# EAGLE design strip_controller (EAGLE 7.2.0)
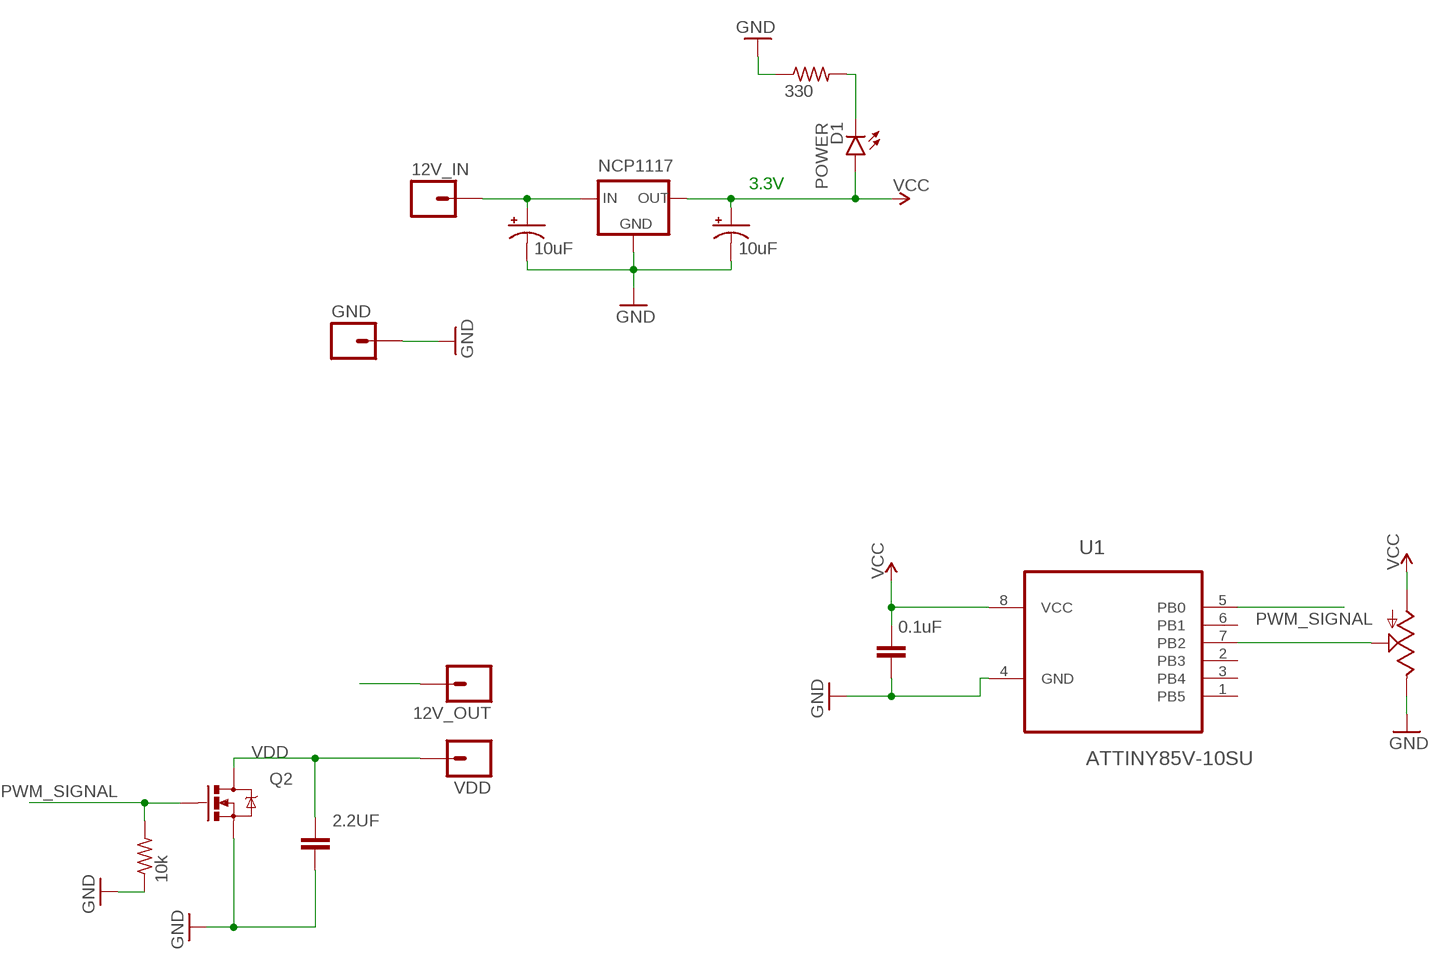
[diagram p0: schematic, sheet 1]

## Parts
12V_IN  WAGO_2060M01  [WAGO_2060]
12V_OUT  WAGO_2060M01  [WAGO_2060]
C2  0.1uF  CAP0805  [0805]
C4  2.2UF  2.2UF50V10%(1206)  [1206]
C5  10uF  CAP-POLCAP-PANASONIC-C  [CAP-PANASONIC-C]
C7  10uF  CAP-POLCAP-PANASONIC-C  [CAP-PANASONIC-C]
D1  POWER  LED-GREEN0603  [LED-0603]
GND  WAGO_2060M01  [WAGO_2060]
NCP1117  VREG-3.3VNCP1117  [TO-252]
Q2  MOSFET-NCHANNELFDD8780  [DPAK]
U1  ATTINY85V-10SU  [SOIC127P798X216-8N]
U$2  BOURNS_SLIDE_POT  [BOURN_SLIDE_POT]
U$3  330  RESISTOR  [RESISTOR-0805]
U$15  10k  RESISTOR  [RESISTOR-0805]
VDD  WAGO_2060M01  [WAGO_2060]

## Nets
3.3V [5V]: C2.1 C7.+ D1.A NCP1117.2(OUT) U1.8(VCC) U$2.P$6 ; supply symbol labelled VCC
12V: 12V_IN.L1.2 12V_OUT.L1.2 C5.+ NCP1117.3(IN)
GND [12V]: C2.2 C4.1 C5.- C7.- GND.L1.2 NCP1117.1(GND) Q2.3(S) U1.4(GND) U$2.P$7 U$3.1 U$15.1
N$4: D1.C U$3.2
PWM_SIGNAL: Q2.1(G) U1.5(PB0) U$15.2
VDD [12V]: C4.2 Q2.4(D) VDD.L1.2
WIPER: U1.7(PB2) U$2.P$5
Unconnected: U1.1(PB5) U1.2(PB3) U1.3(PB4) U1.6(PB1)

## Notes on the sheet
- 3.3V

## Library data of the parts
12V_IN 12V_OUT GND VDD = jt_parts:WAGO_2060
C2 = SparkFun-Capacitors:CAP: Capacitor Standard 0603 ceramic capacitor, and 0.1" leaded capacitor.
C4 = SparkFun-Capacitors:2.2UF50V10%(1206): CAP-10009; PROD_ID: CAP-10009
C5 C7 = jt_parts:CAP-POL: Polarized Caps
D1 = SparkFun-LED:LED-GREEN: Various green LEDs Green LEDs used in SFE Production 0603- DIO-00821 LARGE- DIO-00862 LILYPAD- DIO-09910; PROD_ID: DIO-00821; VALUE: GREEN
NCP1117 = jt_parts:VREG-3.3V
Q2 = SparkFun-DiscreteSemi:MOSFET-NCHANNEL: Common NMOSFET Parts MFG P/N Store ID Prod ID FDD8780 TRANS-09984 SI7820DN TRANS-11055 FDS6630A IC-08089 2N7002PW TRANS-11151 FQP30N06L COM-10213 TRANS-10060 BSS123LT1G TRANS-08345 BSS138 TRANS-00830 BS170 2N7000; PROD_ID: TRANS-09984
U1 = Atmel_By_element14_Batch_1-00:ATTINY85V-10SU: 8-bit Microcontroller with In-System Programmable Flash; MPN: ATTINY85V-10SU; OC_FARNELL: 1455166; OC_NEWARK: 58M3799; PACKAGE: SOIC-8; SUPPLIER: Atmel
U$2 = jt_parts:BOURNS_SLIDE_POT
U$3 U$15 = jt_parts:RESISTOR: Resistor footprints. 0805 modified from Adafruit library.

## Net classes
0 default: width 0.254 mm, clearance 0.203 mm
1 12V: width 2.032 mm, clearance 0.508 mm
2 5V: width 0.305 mm, clearance 0.203 mm

## Board
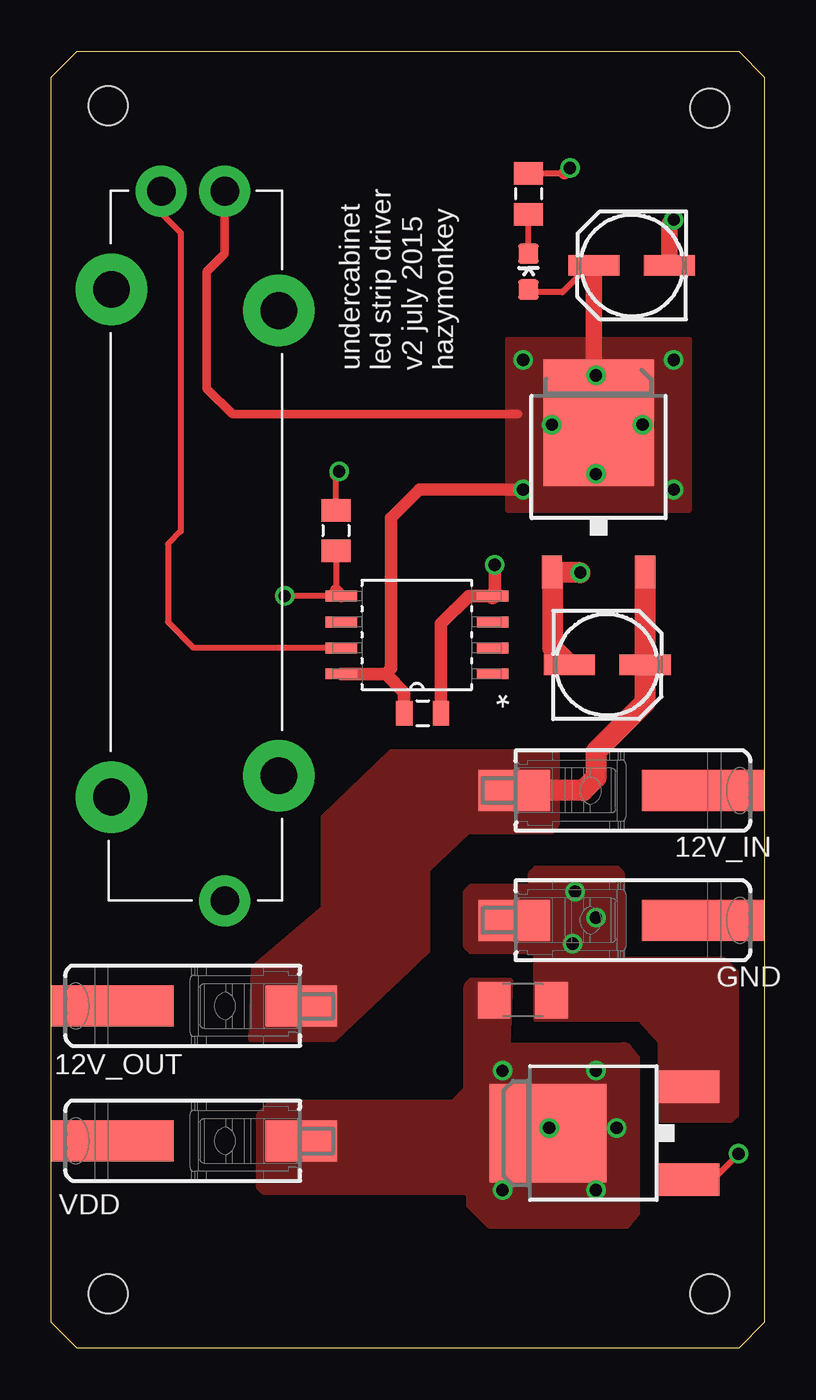
[diagram p1: board, top side]
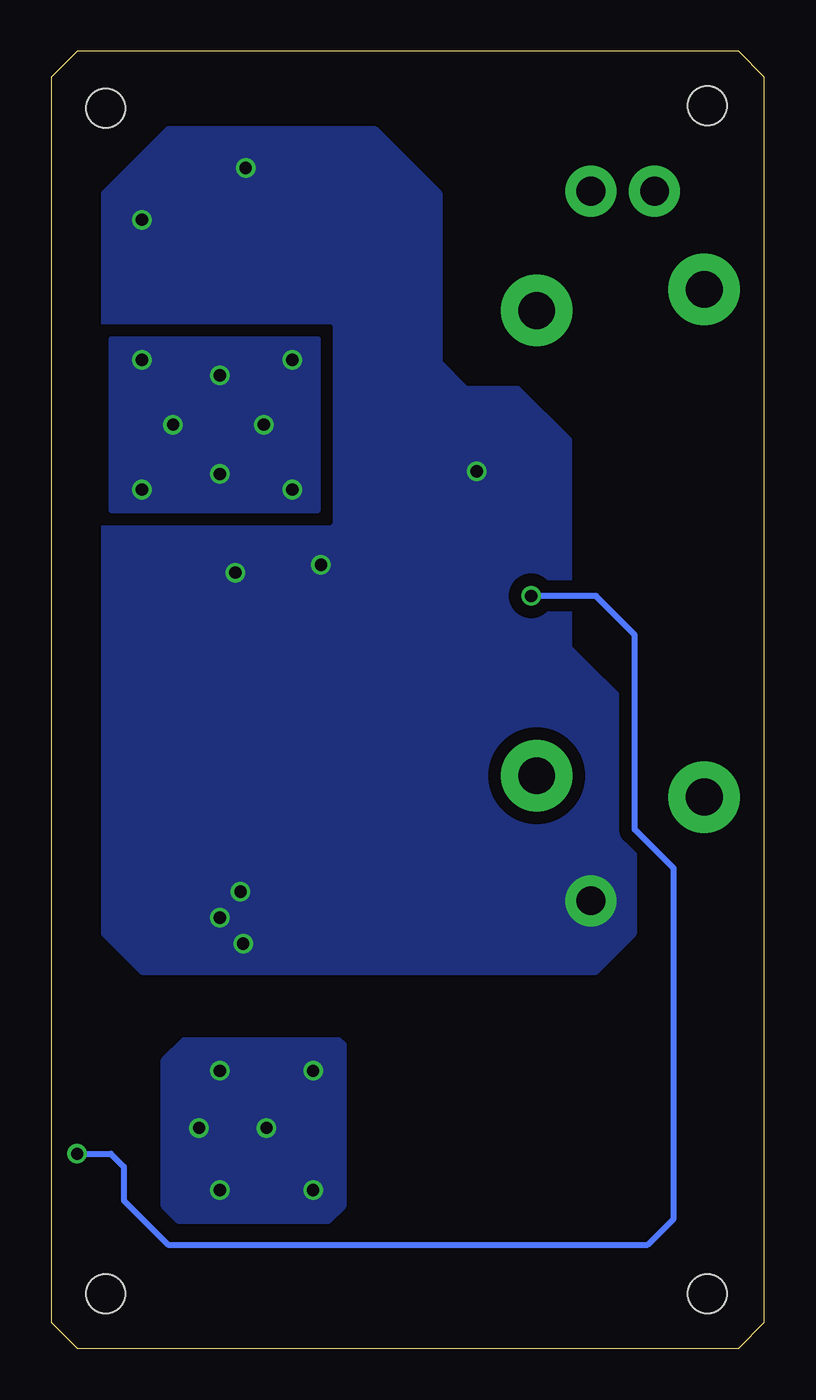
[diagram p2: board, bottom side, seen from below]

Size 34.93 x 63.5 mm. Coordinates in mm from the lower left corner, seen from the top.
Outline: 34.93,62.23 34.93,1.27 33.66,0 1.27,0 0,1.27 0,62.23 1.27,63.5 33.66,63.5 34.93,62.23
Copper layers (1*16): Top 0.0356mm / dielectric 1.5011mm / Bottom 0.0356mm
Design rules "LaenPCBOrder": minimum track width 6mil, minimum drill 13mil, track to track 6mil, track to pad 6mil, pad to pad 6mil, via to via 6mil, smd to smd 6mil, copper to edge 15mil, drill to drill 6mil, minimum pad ring 7mil, minimum via ring 7mil, stop-mask expansion 3mil, vias tented up to drill 0mil, thermal gap 10mil
Holes 1.91 mm at 32.26,2.67 2.79,2.67 32.26,60.71 2.79,60.83

### Footprints (pad centres in the part's own frame; a part is rotated, then mirrored left to right if it is on the bottom)
WAGO_2060 = smd 6 x 2: L1.1 3.355,0 | smd 3.5 x 2: L1.2 -5.895,0
0805 = smd 0.8 x 1.2: 1 -0.9,0; 2 0.9,0
1206 = smd 1.6 x 1.8: 1 -1.4,0; 2 1.4,0
CAP-PANASONIC-C = smd 2.5 x 1: + 1.9,-0.2; - -1.8,-0.2
LED-0603 = smd 1 x 1: A 0,-0.877; C 0,0.877
TO-252 = smd 1 x 1.6: 1 -2.28,-6.07; 3 2.28,-6.07 | smd 5.4 x 6.2: 2 0,1.23
DPAK = smd 1.6 x 3: 1 -2.28,-5.31; 3 2.28,-5.31 | smd 4.826 x 5.715: 4 0,1.588
SOIC127P798X216-8N = smd 1.549 x 0.533: 1 -3.708,1.905; 2 -3.708,0.635; 3 -3.708,-0.635; 4 -3.708,-1.905; 5 3.708,-1.905; 6 3.708,-0.635; 7 3.708,0.635; 8 3.708,1.905
BOURN_SLIDE_POT = drill 1.8 pad 3.5: P$1 -11.43,4.674; P$2 -12.47,-3.526; P$3 12.38,-3.526; P$4 11.341,4.674 | drill 1.4 pad 2.5: P$5 -17.27,-1.087; P$6 -17.27,2.024; P$7 17.457,2.024
RESISTOR-0805 = smd 1.1 x 1.4: 1 -1,0; 2 1,0

### Placement (x,y rotation side)
12V_IN  28.57,27.3 0 top
12V_OUT  6.35,16.76 180 top
C2  18.19,31.09 0 top
C4  23.09,17.04 180 top
C5  27.18,33.66 0 top
C7  28.47,52.81 180 top
D1  23.37,52.7 0 top
GND  28.57,20.95 0 top
NCP1117  26.8,44.07 0 top
Q2  25.91,10.54 90 top
U1  17.91,34.92 180 top
U$2  6.48,39.37 270 top
U$3  23.37,56.52 270 top
U$15  13.94,40.03 270 top
VDD  6.35,10.16 180 top

### Tracks (layer width: path | path; a pad name or v marks a point on that pad's centre or on a via)
3.3V  (via drill 0.6)
  Top 0.305: 26.34,53.01 25.02,51.69 23.51,51.69
  Top 0.406: U$2.P$6 8.5,53.59 7.62,52.7 7.62,46.99 8.89,45.72 22.86,45.72
  Top 0.61: C2.1 17.29,32.12 16.38,33.02 | 16.38,33.02 U1.8 | v23.11,42.04 18.03,42.04 16.64,40.64 16.64,33.27 16.38,33.02 | C7.+ 26.34,53.01 | 23.51,51.69 D1.A
  Top 0.813: C7.+ 26.57,45.52 NCP1117.2
  other vias: 26.67,47.62 30.48,48.39 28.96,45.21 30.48,42.04 26.67,42.8 23.11,48.39 24.51,45.21
  pour Top (no thermals): 22.35,41.02 22.35,49.4 31.24,49.4 31.24,41.02
  pour Bottom (no thermals): 21.84,41.02 21.84,49.4 32,49.4 32,41.02
12V
  Top 0.813: C5.+ 29.08,32.89
  Top 1.016: NCP1117.3 C5.+ | 29.08,32.89 29.08,31.62 26.67,29.21 26.67,27.94 26.04,27.3 12V_IN.L1.2
  pour Top (no thermals): 9.91,18.67 13.34,21.59 13.34,26.04 16.64,29.21 24.76,29.21 24.76,25.65 24.51,25.27 20.41,25.27 18.41,23.4 18.41,19.43 13.84,15.11 9.78,15.11
GND  (via drill 0.6)
  Top 0.305: U$15.1 13.95,42.77 | U$3.1 25.13,57.52
  Top 0.61: v21.72,38.35 21.72,36.93 | C2.2 19.09,35.47 20.45,36.83 U1.4 | 13.95,42.77 v14.1,42.93 | 25.13,57.52 v25.4,57.78
  Top 0.813: 24.54,37.97 NCP1117.1 | 21.72,36.93 U1.4 | C7.- 30.27,55.04 v30.48,55.24
  Top 1.016: v25.91,37.97 24.54,37.97 24.54,34.29 C5.-
  other vias: 26.67,21.08 25.53,19.81 25.65,22.35
  pour Bottom (isolate 0.61, rank 3, no thermals): 19.05,59.69 29.21,59.69 32.39,56.52 32.39,20.32 30.48,18.41 8.26,18.41 6.35,20.32 6.35,31.11 9.53,34.29 9.53,44.45 12.06,46.99 14.61,46.99 15.88,48.26 15.88,56.52
  pour Top (no thermals): 20.32,19.68 20.32,22.35 20.57,22.61 23.49,22.61 23.49,23.24 23.75,23.5 27.69,23.5 27.94,23.24 27.94,19.05 32.89,19.05 33.53,18.41 33.53,11.43 33.27,11.18 29.84,11.18 29.84,14.99 28.83,16.13 23.75,16.13 23.75,19.43 20.57,19.43
N$4
  Top 0.305: D1.C U$3.2
PWM_SIGNAL  (via drill 0.6)
  Top 0.305: U$15.2 13.95,37.08 | U1.5 v11.43,36.83 | Q2.1 32.39,8.26 v33.66,9.53
  Top 0.61: 13.95,37.08 U1.5
  Bottom 0.305: v33.66,9.53 32,9.53 31.37,8.89 31.37,7.24 29.21,5.08 5.71,5.08 4.45,6.35 4.45,23.5 6.35,25.4 6.35,34.92 8.26,36.83 v11.43,36.83
VDD  (via drill 0.6)
  other vias: 22.1,13.59 26.67,13.59 22.1,7.75 26.67,7.75 27.69,10.79 24.38,10.79
  pour Bottom (isolate 0.61, no thermals): 28.45,15.11 29.46,14.1 29.46,6.99 28.7,6.22 21.34,6.22 20.57,6.99 20.57,14.86 20.83,15.11
  pour Top (no thermals): 10.16,7.87 10.16,11.43 10.79,12.06 19.68,12.06 20.32,12.7 20.32,17.67 arc-45 20.39,17.85 20.57,18.03 22.48,18.03 22.35,14.86 27.96,14.86 arc-45 28.27,14.78 28.7,14.22 28.7,6.6 28.19,5.97 21.57,5.97 arc-45 21.39,6.04 20.45,6.99 20.45,7.39 arc45 20.37,7.57 20.32,7.62 10.52,7.62 arc-45 10.34,7.69
WIPER
  Top 0.305: U1.7 6.99,34.29 5.71,35.56 5.71,39.37 6.35,40.01 6.35,54.61 5.39,55.57 U$2.P$5

### Text on the board
tNames: undercabinet / led strip driver / v2 july 2015 / hazymonkey